# EAGLE schematic 206_uv (EAGLE 7.6.0)
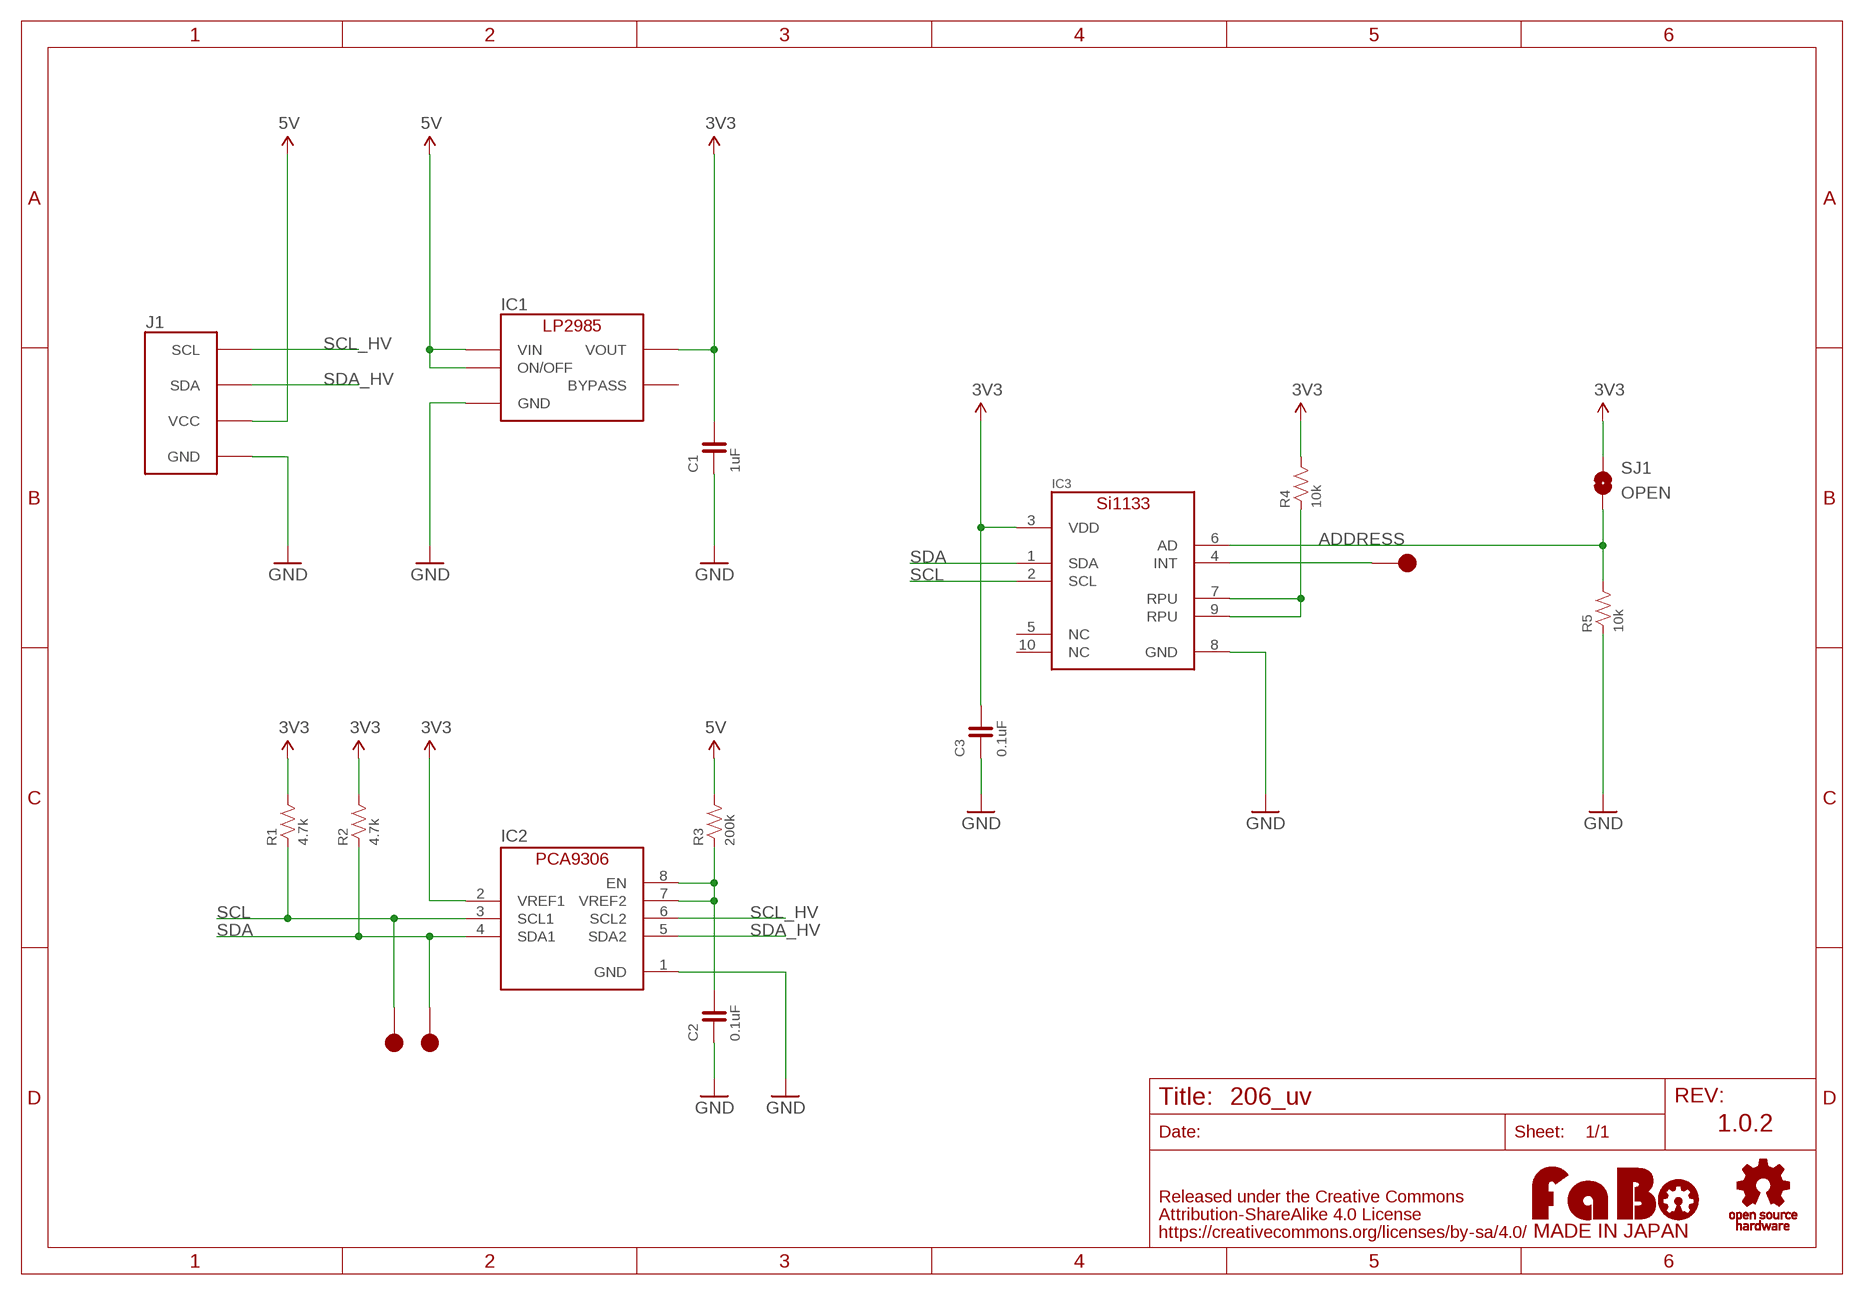
[diagram p0: schematic, sheet 1]

## Parts
C1  1uF  CAPACITOR-0603  [0603]
C2  0.1uF  CAPACITOR-0603  [0603]
C3  0.1uF  CAPACITOR-0603  [0603]
IC1  LP2985-33DBV  [SOT-23-5]
IC2  PCA9306GM  [XQFN8]
IC3  SILICONLABS-SI1133  [SILICONLABS-SI1133]
J1  FABO_BRICK_I2C  [FABO_BRICK_I2C]
R1  4.7k  RESISTOR-0603  [0603]
R2  4.7k  RESISTOR-0603  [0603]
R3  200k  RESISTOR-0603  [0603]
R4  10k  RESISTOR-0603  [0603]
R5  10k  RESISTOR-0603  [0603]
SJ1  OPEN  SMD-JUMPER-2-OPEN  [SMD-JUMPER-2-OPEN]
TP1  TP-15  [TP-15]
TP2  TP-15  [TP-15]
TP3  TP-15  [TP-15]
U$2  LOGO_FABO-M  [LOGO_FABO_MS]
U$3  LOGO_OSHW-M_BOTTOM  [LOGO_OSHW_M_BOTTOM]

## Nets
3V3: C1.2 C3.2 IC1.5(VOUT) IC2.2(VREF1) IC3.3(VDD) R1.2 R2.2 R4.2 SJ1.1
5V: IC1.1(VIN) IC1.3(ON/OFF) J1.VCC R3.2
ADDRESS: IC3.6(AD) R5.2 SJ1.2
GND: C1.1 C2.1 C3.1 IC1.2(GND) IC2.1(GND) IC3.8(GND) J1.GND R5.1
N$1: C2.2 IC2.7(VREF2) IC2.8(EN) R3.1
N$4: IC3.7(RPU) IC3.9(RPU) R4.1
N$6: IC3.4(INT) TP3.1
SCL: IC2.3(SCL1) IC3.2(SCL) R1.1 TP2.1
SCL_HV: IC2.6(SCL2) J1.SCL
SDA: IC2.4(SDA1) IC3.1(SDA) R2.1 TP1.1
SDA_HV: IC2.5(SDA2) J1.SDA
Unconnected: IC1.4(BYPASS) IC3.5(NC) IC3.10(NC)

## Notes on the sheet
- 1.0.2

## Library data of the parts
C1-C3 = FaBo-Capacitor:CAPACITOR: CAPACITOR
IC1 = FaBo-Supply:LP2985: LP2985
IC2 = FaBo-LevelTranslator:PCA9306
IC3 = FaBo-Mems:SILICONLABS-SI1133
J1 = FaBo-Template:FABO_BRICK_I2C: FaBo Brick I2C
R1-R5 = FaBo-Resistors:RESISTOR: RESISTOR
SJ1 = FaBo-Supply:SMD-JUMPER-2
TP1-TP3 = FaBo-Supply:TP
U$2 = FaBo-etc:LOGO_FABO
U$3 = FaBo-etc:LOGO_OSHW